# EAGLE design full_shift_register (EAGLE 9.2.0)
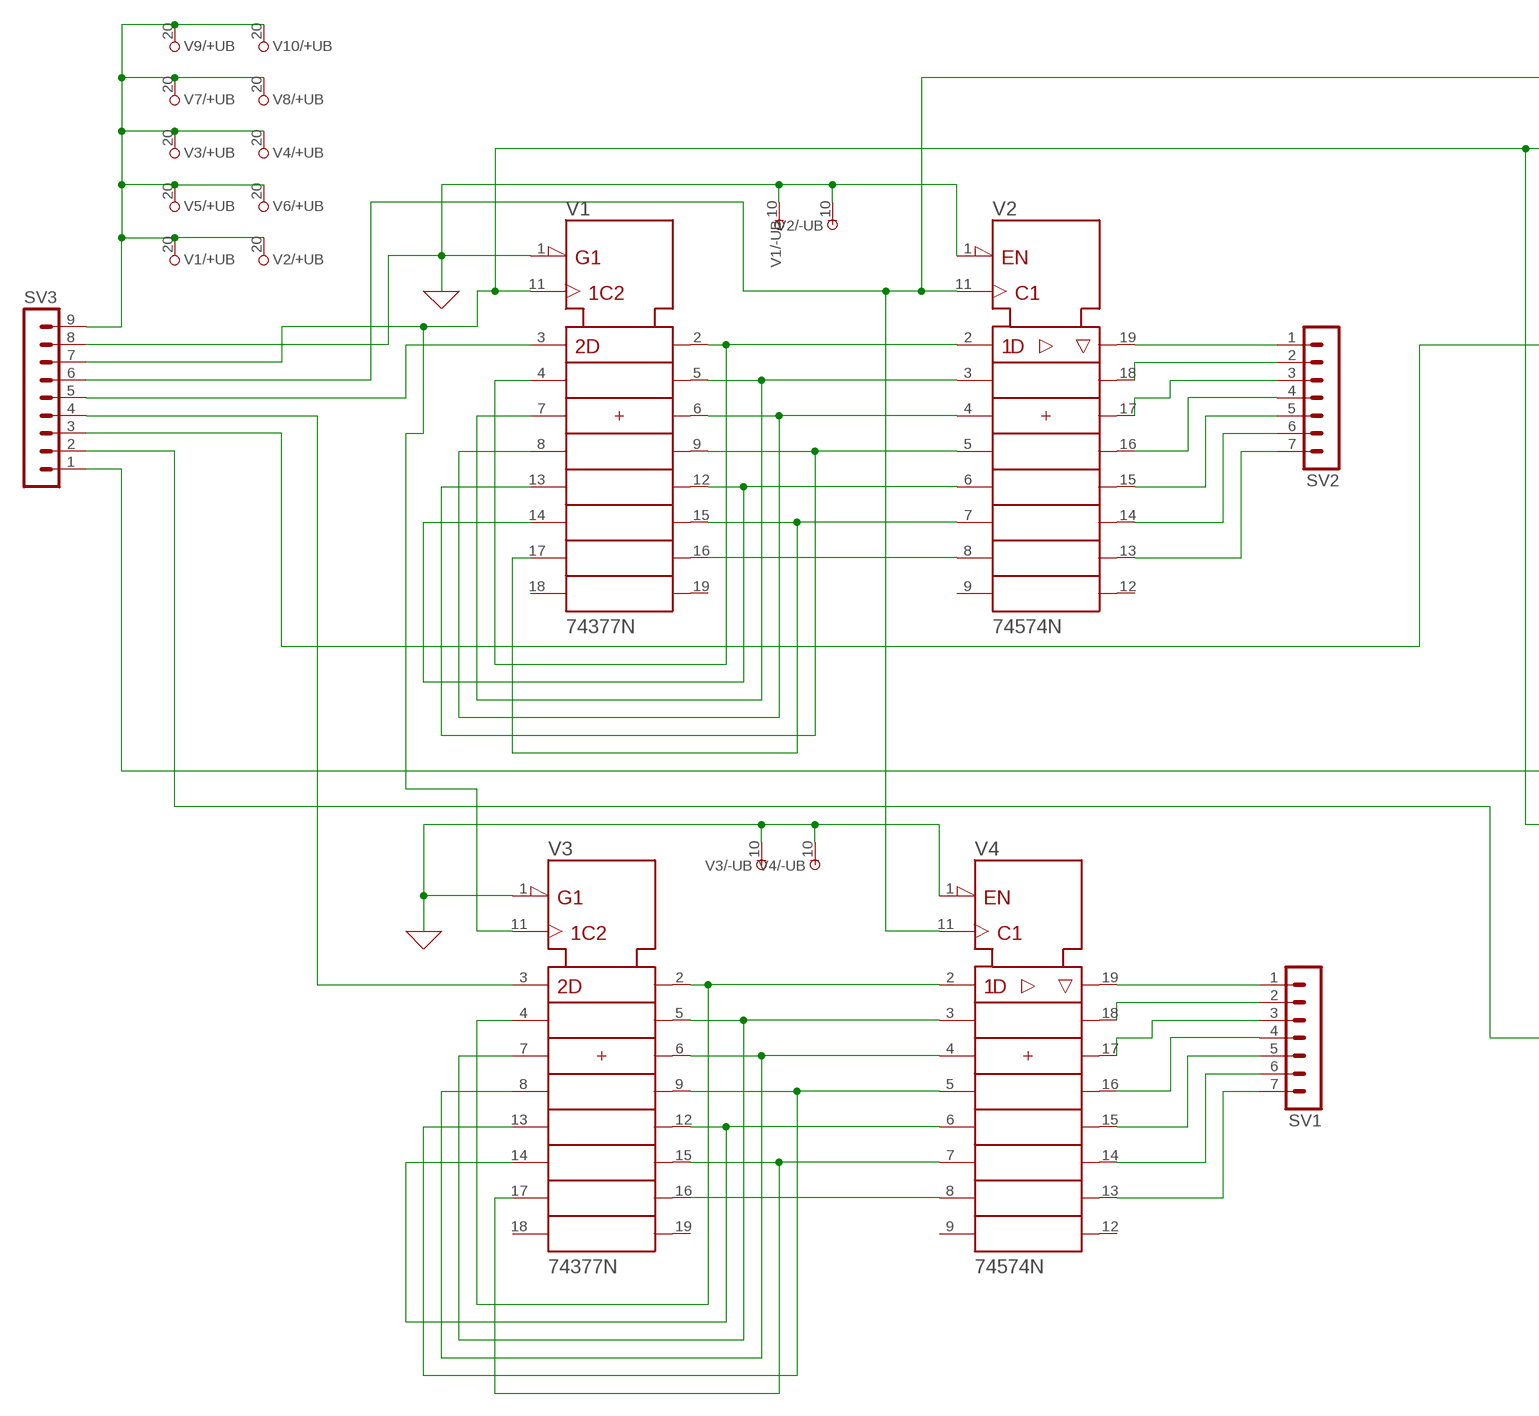
[diagram p0: schematic, sheet 1, part 1 of 2]
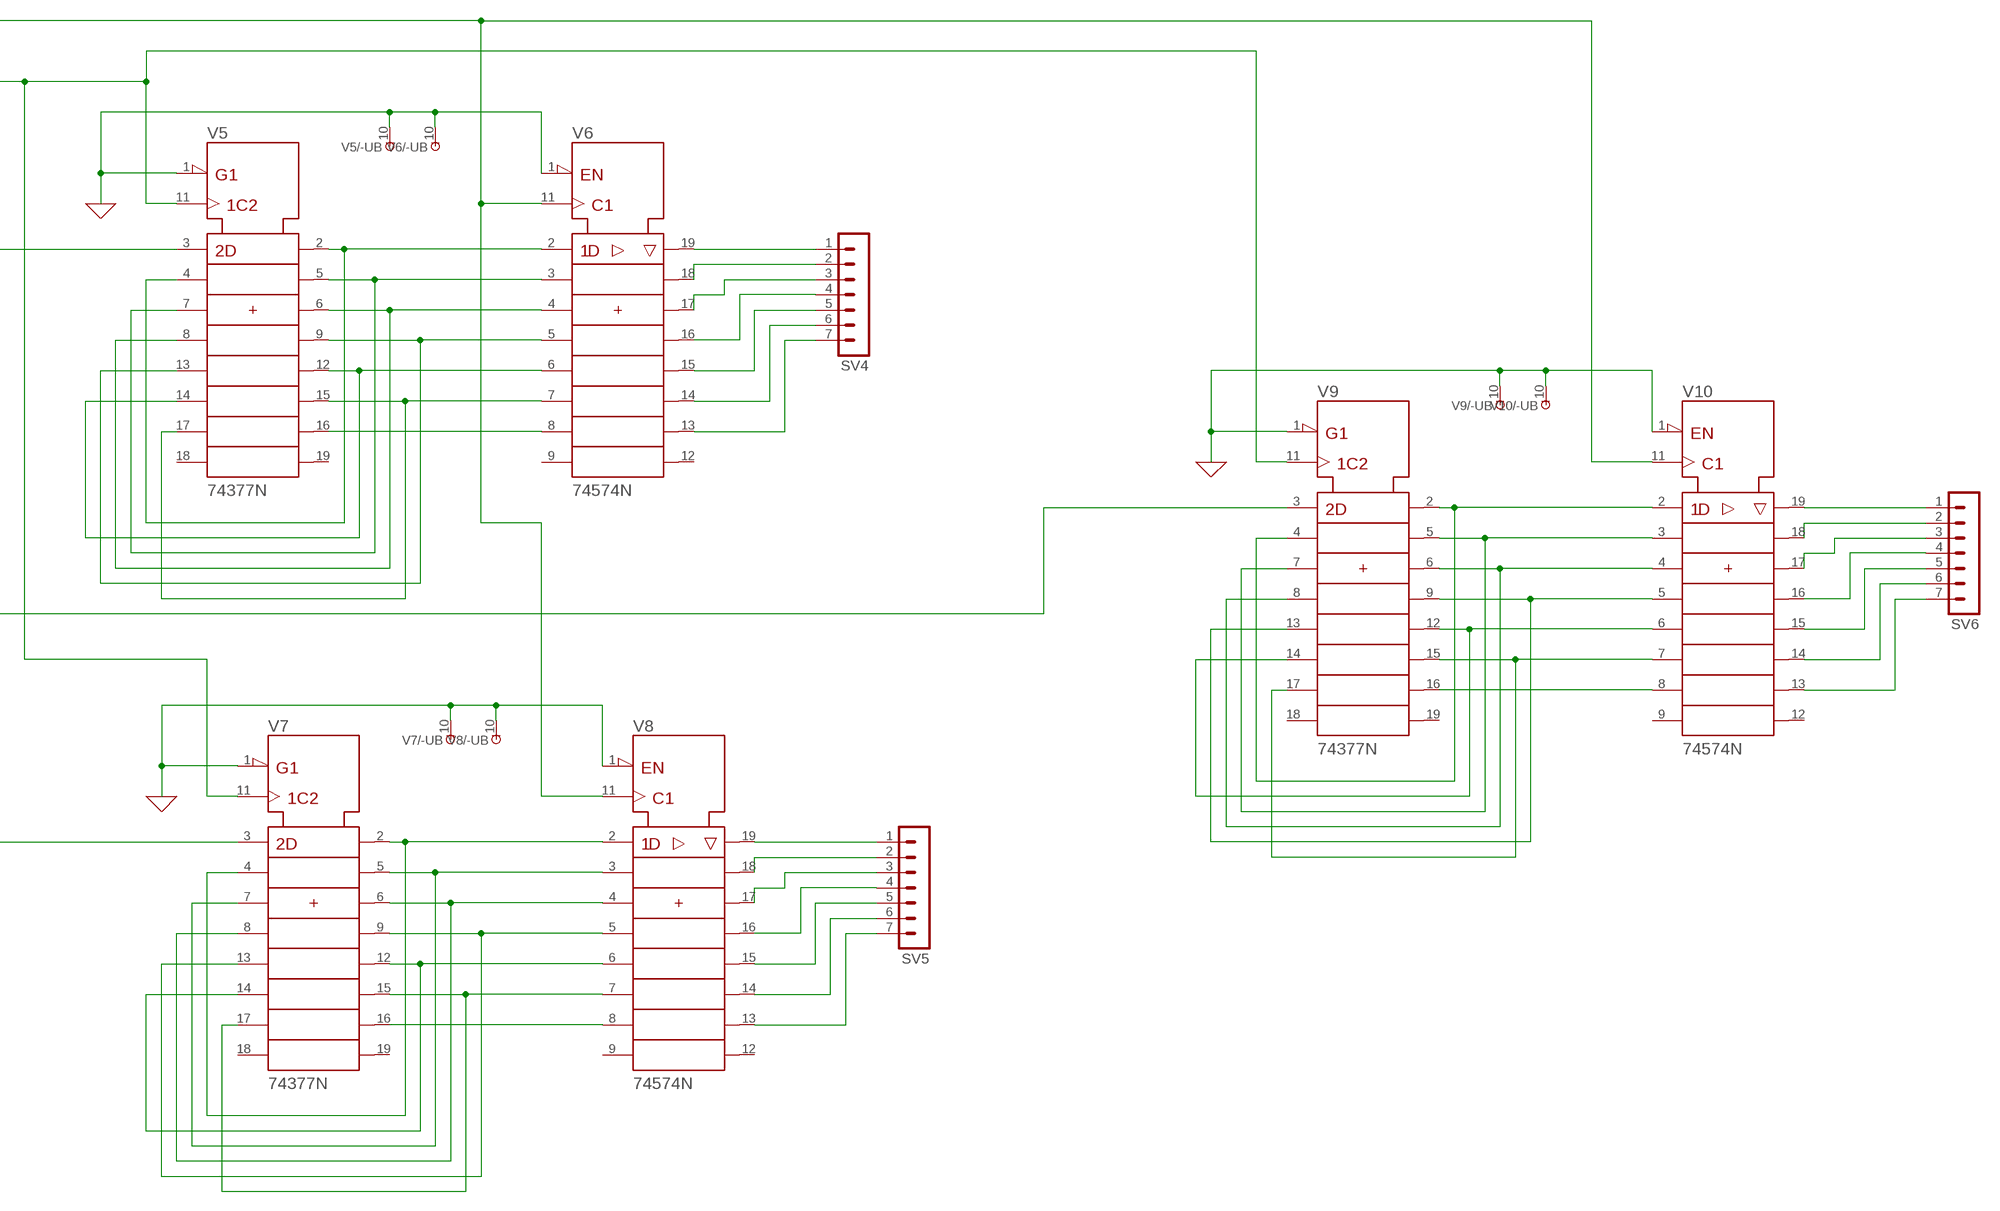
[diagram p1: schematic, sheet 1, part 2 of 2]

## Parts
SV1  MA07-1  [MA07-1]
SV2  MA07-1  [MA07-1]
SV3  MA09-1  [MA09-1]
SV4  MA07-1  [MA07-1]
SV5  MA07-1  [MA07-1]
SV6  MA07-1  [MA07-1]
V1  74377N  [DIL20]
V2  74574N  [DIL20]
V3  74377N  [DIL20]
V4  74574N  [DIL20]
V5  74377N  [DIL20]
V6  74574N  [DIL20]
V7  74377N  [DIL20]
V8  74574N  [DIL20]
V9  74377N  [DIL20]
V10  74574N  [DIL20]

## Nets
0: SV3.8 V1.1(!G) V1.10(-UB) V2.1(!OC) V2.10(-UB) V3.1(!G) V3.10(-UB) V4.1(!OC) V4.10(-UB) V5.1(!G) V5.10(-UB) V6.1(!OC) V6.10(-UB) V7.1(!G) V7.10(-UB) V8.1(!OC) V8.10(-UB) V9.1(!G) V9.10(-UB) V10.1(!OC) V10.10(-UB) ; supply symbol labelled GND
N$1: V1.2(1Q) V1.4(2D) V2.2(1D)
N$2: V1.5(2Q) V1.7(3D) V2.3(2D)
N$3: V1.6(3Q) V1.8(4D) V2.4(3D)
N$4: V1.9(4Q) V1.13(5D) V2.5(4D)
N$5: V1.12(5Q) V1.14(6D) V2.6(5D)
N$6: V1.15(6Q) V1.17(7D) V2.7(6D)
N$7: V1.16(7Q) V2.8(7D)
N$9: SV3.6 V2.11(CLK) V4.11(CLK) V6.11(CLK) V8.11(CLK) V10.11(CLK)
N$10: SV3.5 V1.3(1D)
N$11: SV2.1 V2.19(1Q)
N$12: SV2.2 V2.18(2Q)
N$13: SV2.3 V2.17(3Q)
N$14: SV2.4 V2.16(4Q)
N$15: SV2.5 V2.15(5Q)
N$16: SV2.6 V2.14(6Q)
N$17: SV2.7 V2.13(7Q)
N$18: V3.2(1Q) V3.4(2D) V4.2(1D)
N$19: V3.5(2Q) V3.7(3D) V4.3(2D)
N$20: V3.6(3Q) V3.8(4D) V4.4(3D)
N$21: V3.9(4Q) V3.13(5D) V4.5(4D)
N$22: V3.12(5Q) V3.14(6D) V4.6(5D)
N$23: V3.15(6Q) V3.17(7D) V4.7(6D)
N$24: V3.16(7Q) V4.8(7D)
N$25: SV1.1 V4.19(1Q)
N$26: SV1.2 V4.18(2Q)
N$27: SV1.3 V4.17(3Q)
N$28: SV1.4 V4.16(4Q)
N$29: SV1.5 V4.15(5Q)
N$30: SV1.6 V4.14(6Q)
N$31: SV1.7 V4.13(7Q)
N$32: SV3.4 V3.3(1D)
N$33: V7.2(1Q) V7.4(2D) V8.2(1D)
N$34: V7.5(2Q) V7.7(3D) V8.3(2D)
N$37: V5.2(1Q) V5.4(2D) V6.2(1D)
N$38: V5.5(2Q) V5.7(3D) V6.3(2D)
N$39: V5.6(3Q) V5.8(4D) V6.4(3D)
N$40: V5.9(4Q) V5.13(5D) V6.5(4D)
N$41: V5.12(5Q) V5.14(6D) V6.6(5D)
N$42: V5.15(6Q) V5.17(7D) V6.7(6D)
N$43: V5.16(7Q) V6.8(7D)
N$44: SV4.1 V6.19(1Q)
N$45: SV4.2 V6.18(2Q)
N$46: SV4.3 V6.17(3Q)
N$47: SV4.4 V6.16(4Q)
N$48: SV4.5 V6.15(5Q)
N$49: SV4.6 V6.14(6Q)
N$50: SV4.7 V6.13(7Q)
N$51: SV3.3 V5.3(1D)
N$52: V7.6(3Q) V7.8(4D) V8.4(3D)
N$53: V7.9(4Q) V7.13(5D) V8.5(4D)
N$54: V7.12(5Q) V7.14(6D) V8.6(5D)
N$55: V7.15(6Q) V7.17(7D) V8.7(6D)
N$56: V7.16(7Q) V8.8(7D)
N$57: SV5.1 V8.19(1Q)
N$58: SV5.2 V8.18(2Q)
N$59: SV5.3 V8.17(3Q)
N$60: SV5.4 V8.16(4Q)
N$61: SV5.5 V8.15(5Q)
N$62: SV5.6 V8.14(6Q)
N$63: SV5.7 V8.13(7Q)
N$64: SV3.2 V7.3(1D)
N$65: V9.2(1Q) V9.4(2D) V10.2(1D)
N$66: V9.5(2Q) V9.7(3D) V10.3(2D)
N$67: V9.6(3Q) V9.8(4D) V10.4(3D)
N$68: V9.9(4Q) V9.13(5D) V10.5(4D)
N$69: V9.12(5Q) V9.14(6D) V10.6(5D)
N$70: V9.15(6Q) V9.17(7D) V10.7(6D)
N$71: V9.16(7Q) V10.8(7D)
N$72: SV6.1 V10.19(1Q)
N$73: SV6.2 V10.18(2Q)
N$74: SV6.3 V10.17(3Q)
N$75: SV6.4 V10.16(4Q)
N$76: SV6.5 V10.15(5Q)
N$77: SV6.6 V10.14(6Q)
N$78: SV6.7 V10.13(7Q)
N$79: SV3.1 V9.3(1D)
N$80: SV3.7 V1.11(CLK) V3.11(CLK) V5.11(CLK) V7.11(CLK) V9.11(CLK)
N$82: SV3.9 V1.20(+UB) V2.20(+UB) V3.20(+UB) V4.20(+UB) V5.20(+UB) V6.20(+UB) V7.20(+UB) V8.20(+UB) V9.20(+UB) V10.20(+UB)
Unconnected: V1.18(8D) V1.19(8Q) V2.9(8D) V2.12(8Q) V3.18(8D) V3.19(8Q) V4.9(8D) V4.12(8Q) V5.18(8D) V5.19(8Q) V6.9(8D) V6.12(8Q) V7.18(8D) V7.19(8Q) V8.9(8D) V8.12(8Q) V9.18(8D) V9.19(8Q) V10.9(8D) V10.12(8Q)

## Library data of the parts
SV1 SV2 SV4-SV6 = con-lstb:MA07-1: PIN HEADER; OC_FARNELL: unknown; OC_NEWARK: unknown
SV3 = con-lstb:MA09-1: PIN HEADER; OC_FARNELL: unknown; OC_NEWARK: unknown
V1 V3 V5 V7 V9 = 74ttl-din:74*377: Octal D type FLIP FLOP, enable
V2 V4 V6 V8 V10 = 74ttl-din:74*574: 8-bit D type FLIP FLOP bus driver

## Board
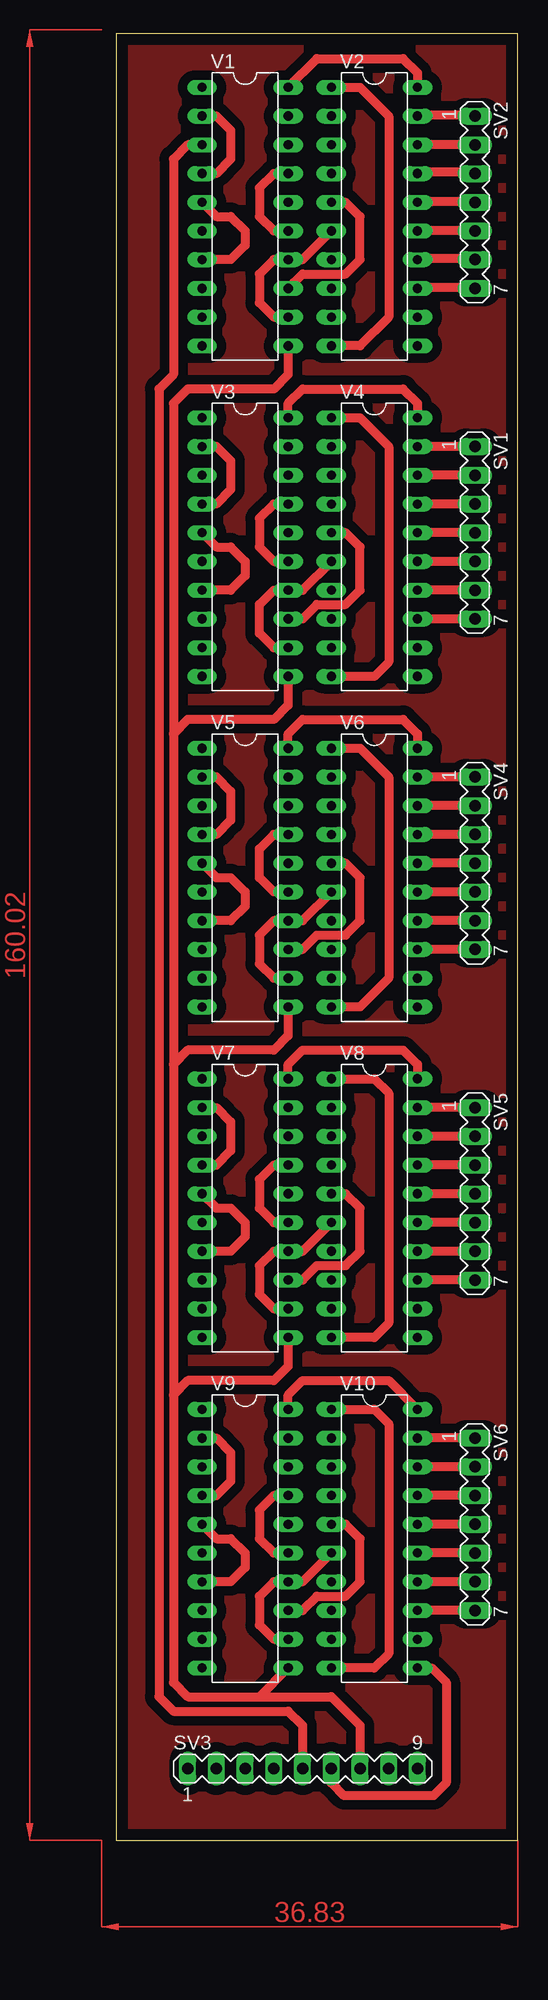
[diagram p2: board, top side]
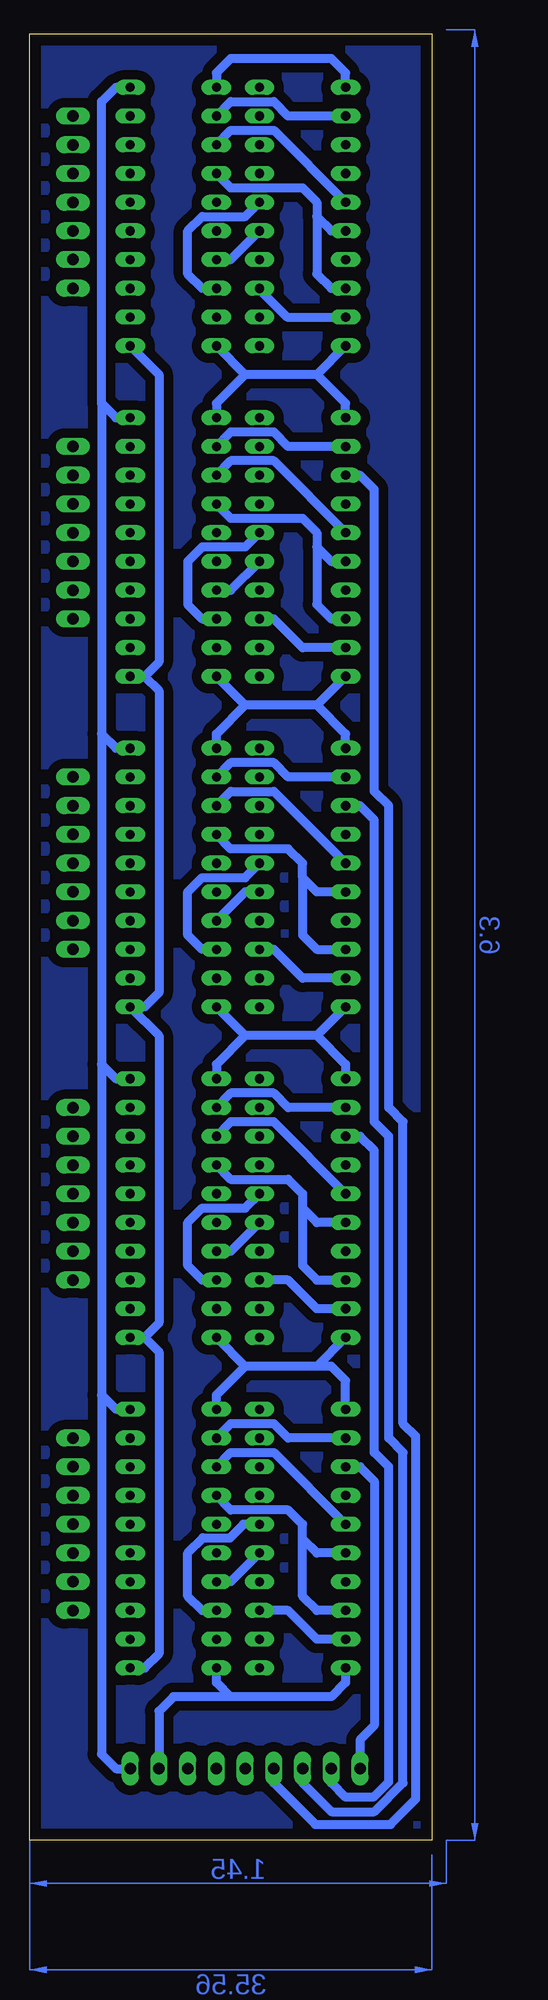
[diagram p3: board, bottom side, seen from below]

Size 35.54 x 159.69 mm. Coordinates in mm from the lower left corner, seen from the top.
Outline: 0,0 35.54,0 35.54,159.69 0,159.69 0,0
Copper layers (1*16): Top 0.035mm / dielectric 1.5mm / Bottom 0.035mm
Design rules "default": minimum track width 6mil, minimum drill 0.35mm, track to track 6mil, track to pad 6mil, pad to pad 6mil, via to via 6mil, smd to smd 6mil, copper to edge 40mil, drill to drill 6mil, minimum pad ring 10mil, minimum via ring 8mil, stop-mask expansion 4mil, vias tented up to drill 0mil, thermal gap 10mil

### Footprints (pad centres in the part's own frame; a part is rotated, then mirrored left to right if it is on the bottom)
MA07-1 = drill 1.016 long: 1 -7.62,0; 2 -5.08,0; 3 -2.54,0; 4 0,0; 5 2.54,0; 6 5.08,0; 7 7.62,0
MA09-1 = drill 1.016 long: 1 -10.16,0; 2 -7.62,0; 3 -5.08,0; 4 -2.54,0; 5 0,0; 6 2.54,0; 7 5.08,0; 8 7.62,0; 9 10.16,0
DIL20 = drill 0.813 long: 1 -11.43,-3.81; 2 -8.89,-3.81; 3 -6.35,-3.81; 4 -3.81,-3.81; 5 -1.27,-3.81; 6 1.27,-3.81; 7 3.81,-3.81; 8 6.35,-3.81; 9 8.89,-3.81; 10 11.43,-3.81; 11 11.43,3.81; 12 8.89,3.81; 13 6.35,3.81; 14 3.81,3.81; 15 1.27,3.81; 16 -1.27,3.81; 17 -3.81,3.81; 18 -6.35,3.81; 19 -8.89,3.81; 20 -11.43,3.81

### Placement (x,y rotation side)
SV1  31.75,115.57 270 top
SV2  31.75,144.78 270 top
SV3  16.51,6.35 0 top
SV4  31.75,86.36 270 top
SV5  31.75,57.15 270 top
SV6  31.75,27.94 270 top
V1  11.43,143.51 270 top
V2  22.86,143.51 270 top
V3  11.43,114.3 270 top
V4  22.86,114.3 270 top
V5  11.43,85.09 270 top
V6  22.86,85.09 270 top
V7  11.43,55.88 270 top
V8  22.86,55.88 270 top
V9  11.43,26.67 270 top
V10  22.86,26.67 270 top

### Tracks (layer width: path | path; a pad name or v marks a point on that pad's centre or on a via)
0
  Top 0.152: V2.1 19,155.04
  Top 0.813: V4.10 22.86,102.87 24.13,104.14 24.13,123.19 21.59,125.73 V4.1 | V2.10 21.59,132.08 24.13,134.62 24.13,152.4 21.59,154.94 V2.1 | V6.1 21.59,96.52 24.13,93.98 24.13,76.2 21.59,73.66 V6.10 | V8.1 22.86,67.31 24.13,66.04 24.13,45.72 22.86,44.45 V8.10 | V10.1 22.86,38.1 24.13,36.83 24.13,16.51 22.86,15.24 V10.10
  Bottom 0.813: V1.10 10.16,129.54 | 10.16,129.54 16.51,129.54 | V2.10 16.51,129.54 | V3.1 7.62,127 10.16,129.54 | 16.51,129.54 19.05,127 V4.1 | V3.10 10.16,100.33 | 10.16,100.33 16.51,100.33 | 16.51,100.33 V4.10 | V5.1 7.62,97.79 10.16,100.33 | V6.1 19.05,97.79 16.51,100.33 | V5.10 10.16,71.12 | 10.16,71.12 16.51,71.12 | 16.51,71.12 V6.10 | 10.16,71.12 7.62,68.58 V7.1 | 16.51,71.12 19.05,68.58 V8.1 | V1.1 7.62,156.21 8.89,157.48 17.78,157.48 19.05,156.21 V2.1 | V7.10 10.16,41.91 | 10.16,41.91 16.51,41.91 | 16.51,41.91 V8.10 | V9.1 7.62,40.64 8.89,41.91 10.16,41.91 | V10.1 19.05,39.37 16.51,41.91 | V9.10 7.62,13.97 8.89,12.7 17.78,12.7 | 17.78,12.7 19.05,13.97 V10.10 | SV3.8 24.13,11.43 22.86,12.7 17.78,12.7
BLUE
  pour Bottom (isolate 0.838): 0,160.02 35.56,160.02 35.56,0 0,0
N$1
  Top 0.152: 7.62,152.3 V1.2 | V2.2 19,152.3
  Top 0.813: V1.2 8.89,152.4 10.16,151.13 10.16,148.59 8.89,147.32 V1.4
  Bottom 0.813: V1.2 12.7,152.4 13.97,153.67 17.78,153.67 V2.2
N$2
  Top 0.152: 7.62,140.26 V1.7 | 7.62,144.68 V1.5
  Top 0.813: V1.5 8.89,143.51 10.16,143.51 11.43,142.24 11.43,140.97 10.16,139.7 V1.7
  Bottom 0.152: 7.62,144.83 V1.5
  Bottom 0.813: V2.3 17.78,151.13 13.97,151.13 V1.5
N$3
  Top 0.152: 7.62,137.67 V1.8 | V2.4 19,147.27
  Bottom 0.813: V2.4 17.78,146.05 11.43,146.05 10.16,144.78 10.16,143.51 | 10.16,143.51 8.89,142.24 V1.6 | 10.16,143.51 10.16,138.43 8.89,137.16 V1.8
N$4
  Top 0.813: V1.13 16.51,138.43 20.32,138.43 21.59,139.7 21.59,143.51 20.32,144.78 V2.5
  Bottom 0.152: 15.24,137.06 V1.13
  Bottom 0.813: V1.9 12.8,134.62 15.24,137.06
N$5
  Top 0.152: 15.24,139.65 V1.14
  Top 0.813: V1.12 13.97,134.62 12.7,135.89 12.7,138.43 13.97,139.7 V1.14 16.51,139.7 V2.6
N$6
  Top 0.813: V1.17 13.97,147.32 12.7,146.05 12.7,143.51 13.97,142.24 V1.15
  Bottom 0.152: V2.7 19,139.8
  Bottom 0.813: V2.7 17.78,139.7 V1.15
N$7
  Bottom 0.152: 15.24,144.68 V1.16
  Bottom 0.813: V1.16 16.51,143.51 20.32,143.51 21.59,142.24 21.59,138.43 20.32,137.16 V2.8
N$9
  Top 0.813: V10.11 27.94,15.24 29.21,13.97 29.21,5.08 28.09,3.96 20.17,3.96 19.05,5.08 SV3.6
  Bottom 0.813: V2.11 24.13,129.54 24.13,104.14 25.4,102.87 | V4.11 25.4,102.87 | 25.4,102.87 24.13,101.6 24.13,74.93 25.4,73.66 V6.11 24.13,71.12 24.13,45.72 25.4,44.45 | V8.11 25.4,44.45 | 25.4,44.45 24.13,43.18 24.13,16.51 25.4,15.24 V10.11
N$10
  Top 0.813: V1.3 6.35,149.86 5.08,148.59 5.08,129.54 3.81,128.27 3.81,12.7 5.08,11.43 15.24,11.43 16.51,10.16 SV3.5
N$11
  Top 0.152: 26.77,152.45 V2.19 | SV2.1 31.65,152.45
  Top 0.813: 31.65,152.45 26.77,152.45
N$12
  Top 0.813: SV2.2 V2.18
N$13
  Top 0.152: 26.77,147.42 V2.17 | SV2.3 31.65,147.42
  Top 0.813: 31.65,147.42 26.77,147.42
N$14
  Top 0.152: 26.77,144.83 V2.16 | SV2.4 31.65,144.83
  Top 0.813: 31.65,144.83 26.77,144.83
N$15
  Top 0.813: SV2.5 V2.15
N$16
  Top 0.152: 26.77,139.8 V2.14 | SV2.6 31.65,139.8
  Top 0.813: 31.65,139.8 26.77,139.8
N$17
  Top 0.152: 26.77,137.21 V2.13 | SV2.7 31.65,137.21
  Top 0.813: 31.65,137.21 26.77,137.21
N$18
  Top 0.813: V3.2 8.89,123.19 10.16,121.92 10.16,119.38 8.89,118.11 V3.4
  Bottom 0.813: V3.2 12.7,123.19 13.97,124.46 17.78,124.46 V4.2
N$19
  Top 0.813: V3.5 8.89,114.3 10.16,114.3 11.43,113.03 11.43,111.76 10.16,110.49 V3.7
  Bottom 0.813: V4.3 17.78,121.92 13.97,121.92 V3.5
N$20
  Bottom 0.813: V4.4 17.78,116.84 11.43,116.84 10.16,115.57 10.16,114.3 | 10.16,114.3 8.89,113.03 V3.6 | V3.8 8.89,107.95 10.16,109.22 10.16,114.3
N$21
  Top 0.813: V3.13 16.51,107.95 17.78,109.22 20.32,109.22 21.59,110.49 21.59,114.3 20.32,115.57 V4.5
  Bottom 0.813: V3.9 11.43,105.41 13.97,107.95 V3.13
N$22
  Top 0.813: V3.12 13.97,105.41 12.7,106.68 12.7,109.22 13.97,110.49 V3.14 16.51,110.49 V4.6
N$23
  Top 0.813: V3.17 13.97,118.11 12.7,116.84 12.7,114.3 13.97,113.03 V3.15
  Bottom 0.813: V3.15 17.78,110.49 V4.7
N$24
  Bottom 0.813: V3.16 16.51,114.3 20.32,114.3 21.59,113.03 21.59,109.22 20.32,107.95 V4.8
N$25
  Top 0.813: SV1.1 V4.19
N$26
  Top 0.813: SV1.2 V4.18
N$27
  Top 0.813: SV1.3 V4.17
N$28
  Top 0.813: SV1.4 V4.16
N$29
  Top 0.813: SV1.5 V4.15
N$30
  Top 0.813: SV1.6 V4.14
N$31
  Top 0.813: SV1.7 V4.13
N$32
  Bottom 0.813: SV3.4 13.97,5.08 10.31,1.42 3.66,1.42 1.42,3.66 1.42,35.71 2.54,36.83 2.54,63.5 3.81,64.77 3.81,91.44 5.08,92.71 5.08,119.38 6.35,120.65 V3.3
N$33
  Top 0.813: V7.2 8.89,64.77 10.16,63.5 10.16,60.96 8.89,59.69 V7.4
  Bottom 0.813: V7.2 12.7,64.77 13.97,66.04 17.78,66.04 V8.2
N$34
  Top 0.813: V7.5 8.89,55.88 10.16,55.88 11.43,54.61 11.43,53.34 10.16,52.07 V7.7
  Bottom 0.813: V7.5 13.97,63.5 17.78,63.5 V8.3
N$37
  Top 0.813: V5.2 8.89,93.98 10.16,92.71 10.16,90.17 8.89,88.9 V5.4
  Bottom 0.813: V5.2 12.7,93.98 13.97,95.25 17.78,95.25 V6.2
N$38
  Top 0.813: V5.5 8.89,85.09 10.16,85.09 11.43,83.82 11.43,82.55 10.16,81.28 V5.7
  Bottom 0.813: V6.3 17.78,92.71 13.97,92.71 V5.5
N$39
  Bottom 0.813: V5.6 10.16,83.82 11.43,85.09 | 11.43,85.09 11.43,86.36 12.7,87.63 17.78,87.63 V6.4 | V5.8 10.16,78.74 11.43,80.01 11.43,85.09
N$40
  Top 0.813: V5.13 16.51,78.74 17.78,80.01 20.32,80.01 21.59,81.28 21.59,85.09 20.32,86.36 V6.5
  Bottom 0.813: V5.9 11.43,76.2 13.97,78.74 V5.13
N$41
  Top 0.813: V5.12 13.97,76.2 12.7,77.47 12.7,80.01 13.97,81.28 V5.14 16.51,81.28 V6.6
N$42
  Top 0.813: V5.15 13.97,83.82 12.7,85.09 12.7,87.63 13.97,88.9 V5.17
  Bottom 0.813: V5.15 16.51,83.82 V6.7
N$43
  Bottom 0.813: V5.16 16.51,85.09 20.32,85.09 21.59,83.82 21.59,80.01 20.32,78.74 V6.8
N$44
  Top 0.813: SV4.1 V6.19
N$45
  Top 0.813: SV4.2 V6.18
N$46
  Top 0.813: SV4.3 V6.17
N$47
  Top 0.813: SV4.4 V6.16
N$48
  Top 0.813: SV4.5 V6.15
N$49
  Top 0.813: SV4.6 V6.14
N$50
  Top 0.813: SV4.7 V6.13
N$51
  Bottom 0.813: SV3.3 11.43,5.08 8.89,2.54 5.08,2.54 2.54,5.08 2.54,34.29 3.81,35.56 3.81,62.23 5.08,63.5 5.08,90.17 6.35,91.44 V5.3
N$52
  Bottom 0.813: V8.4 17.78,58.42 12.7,58.42 11.43,57.15 11.43,55.88 | 11.43,55.88 11.43,50.8 10.16,49.53 V7.8 | V7.6 10.16,54.61 11.43,55.88
N$53
  Top 0.813: V7.13 16.51,49.53 17.78,50.8 20.32,50.8 21.59,52.07 21.59,55.88 20.32,57.15 V8.5
  Bottom 0.813: V7.9 10.16,46.99 12.7,49.53 V7.13
N$54
  Top 0.813: V7.12 13.97,46.99 12.7,48.26 12.7,50.8 13.97,52.07 V7.14 16.51,52.07 V8.6
N$55
  Top 0.813: V7.17 13.97,59.69 12.7,58.42 12.7,55.88 13.97,54.61 V7.15
  Bottom 0.813: V7.15 17.78,52.07 V8.7
N$56
  Bottom 0.813: V7.16 16.51,55.88 20.32,55.88 21.59,54.61 21.59,50.8 20.32,49.53 V8.8
N$57
  Top 0.813: SV5.1 V8.19
N$58
  Top 0.813: SV5.2 V8.18
N$59
  Top 0.813: SV5.3 V8.17
N$60
  Top 0.813: SV5.4 V8.16
N$61
  Top 0.813: SV5.5 V8.15
N$62
  Top 0.813: SV5.6 V8.14
N$63
  Top 0.813: SV5.7 V8.13
N$64
  Bottom 0.813: SV3.2 8.89,5.08 7.62,3.81 5.18,3.81 3.81,5.18 3.81,33.02 5.08,34.29 5.08,60.96 6.35,62.23 V7.3
N$65
  Top 0.813: V9.2 8.89,35.56 10.16,34.29 10.16,31.75 8.89,30.48 V9.4
  Bottom 0.813: V9.2 12.7,35.56 13.97,36.83 17.78,36.83 V10.2
N$66
  Top 0.813: V9.5 8.89,26.67 10.16,26.67 11.43,25.4 11.43,24.13 10.16,22.86 V9.7
  Bottom 0.813: V10.3 17.78,34.29 13.97,34.29 V9.5
N$67
  Bottom 0.813: V9.8 10.16,20.32 11.43,21.59 11.43,26.67 | 11.43,26.67 11.43,27.94 12.7,29.21 17.78,29.21 V10.4 | V9.6 10.16,25.4 11.43,26.67
N$68
  Top 0.813: V9.13 16.51,20.32 17.78,21.59 20.32,21.59 21.59,22.86 21.59,26.67 20.32,27.94 V10.5
  Bottom 0.813: V9.9 10.16,17.78 12.7,20.32 V9.13
N$69
  Top 0.813: V9.12 13.97,17.78 12.7,19.05 12.7,21.59 13.97,22.86 V9.14 16.51,22.86 V10.6
N$70
  Top 0.813: V9.17 13.97,30.48 12.7,29.21 12.7,26.67 13.97,25.4 V9.15
  Bottom 0.813: V9.15 17.78,22.86 V10.7
N$71
  Bottom 0.813: V9.16 16.66,27.94 17.86,26.75 17.88,26.72 20.21,26.72 20.24,26.75 21.59,25.4 21.59,21.59 20.32,20.32 V10.8
N$72
  Top 0.813: SV6.1 V10.19
N$73
  Top 0.813: SV6.2 V10.18
N$74
  Top 0.813: SV6.3 V10.17
N$75
  Top 0.813: SV6.4 V10.16
N$76
  Top 0.813: SV6.5 V10.15
N$77
  Top 0.813: SV6.6 V10.14
N$78
  Top 0.813: SV6.7 V10.13
N$79
  Bottom 0.813: V9.3 6.35,33.02 5.08,31.75 5.08,10.16 6.35,8.89 SV3.1
N$80
  Top 0.813: V1.11 15.24,129.54 13.97,128.27 6.35,128.27 5.08,127 5.08,97.79 | 5.08,97.79 5.08,68.58 | 5.08,68.58 5.08,39.37 | 5.08,39.37 5.08,13.97 6.35,12.7 12.7,12.7 | 12.7,12.7 V9.11 | V7.11 15.24,41.91 13.97,40.64 6.35,40.64 5.08,39.37 | V5.11 15.24,71.12 13.97,69.85 6.35,69.85 5.08,68.58 | V3.11 15.24,100.33 13.97,99.06 6.35,99.06 5.08,97.79 | 12.7,12.7 19.05,12.7 21.59,10.16 SV3.7
N$82
  Top 0.813: V1.20 17.78,157.48 25.4,157.48 26.67,156.21 V2.20 | V9.20 15.24,39.37 16.51,40.64 24.13,40.64 V10.20 | V7.20 15.24,68.58 16.51,69.85 25.4,69.85 26.67,68.58 V8.20 | V5.20 15.24,97.79 16.51,99.06 25.4,99.06 26.67,97.79 V6.20 | V3.20 15.24,127 16.51,128.27 25.4,128.27 26.67,127 V4.20
  Bottom 0.813: V2.20 27.94,154.94 29.21,153.67 29.21,127 | V4.20 27.94,125.73 29.21,127 | 29.21,127 29.21,97.79 | 29.21,97.79 27.94,96.52 V6.20 | 29.21,68.58 27.94,67.31 V8.20 | 29.21,97.79 29.21,68.58 | 29.21,68.58 29.21,39.37 | 29.21,39.37 27.94,38.1 V10.20 | SV3.9 27.94,6.35 29.21,7.62 29.21,39.37
RED
  pour Top (isolate 0.838): 0,160.02 35.56,160.02 35.56,0 0,0
(copper drawn outside any net)
  shapes: Bottom area x3, Top area x2